# EAGLE design Backplane_Reference_R2_0 (EAGLE 6.6.0)
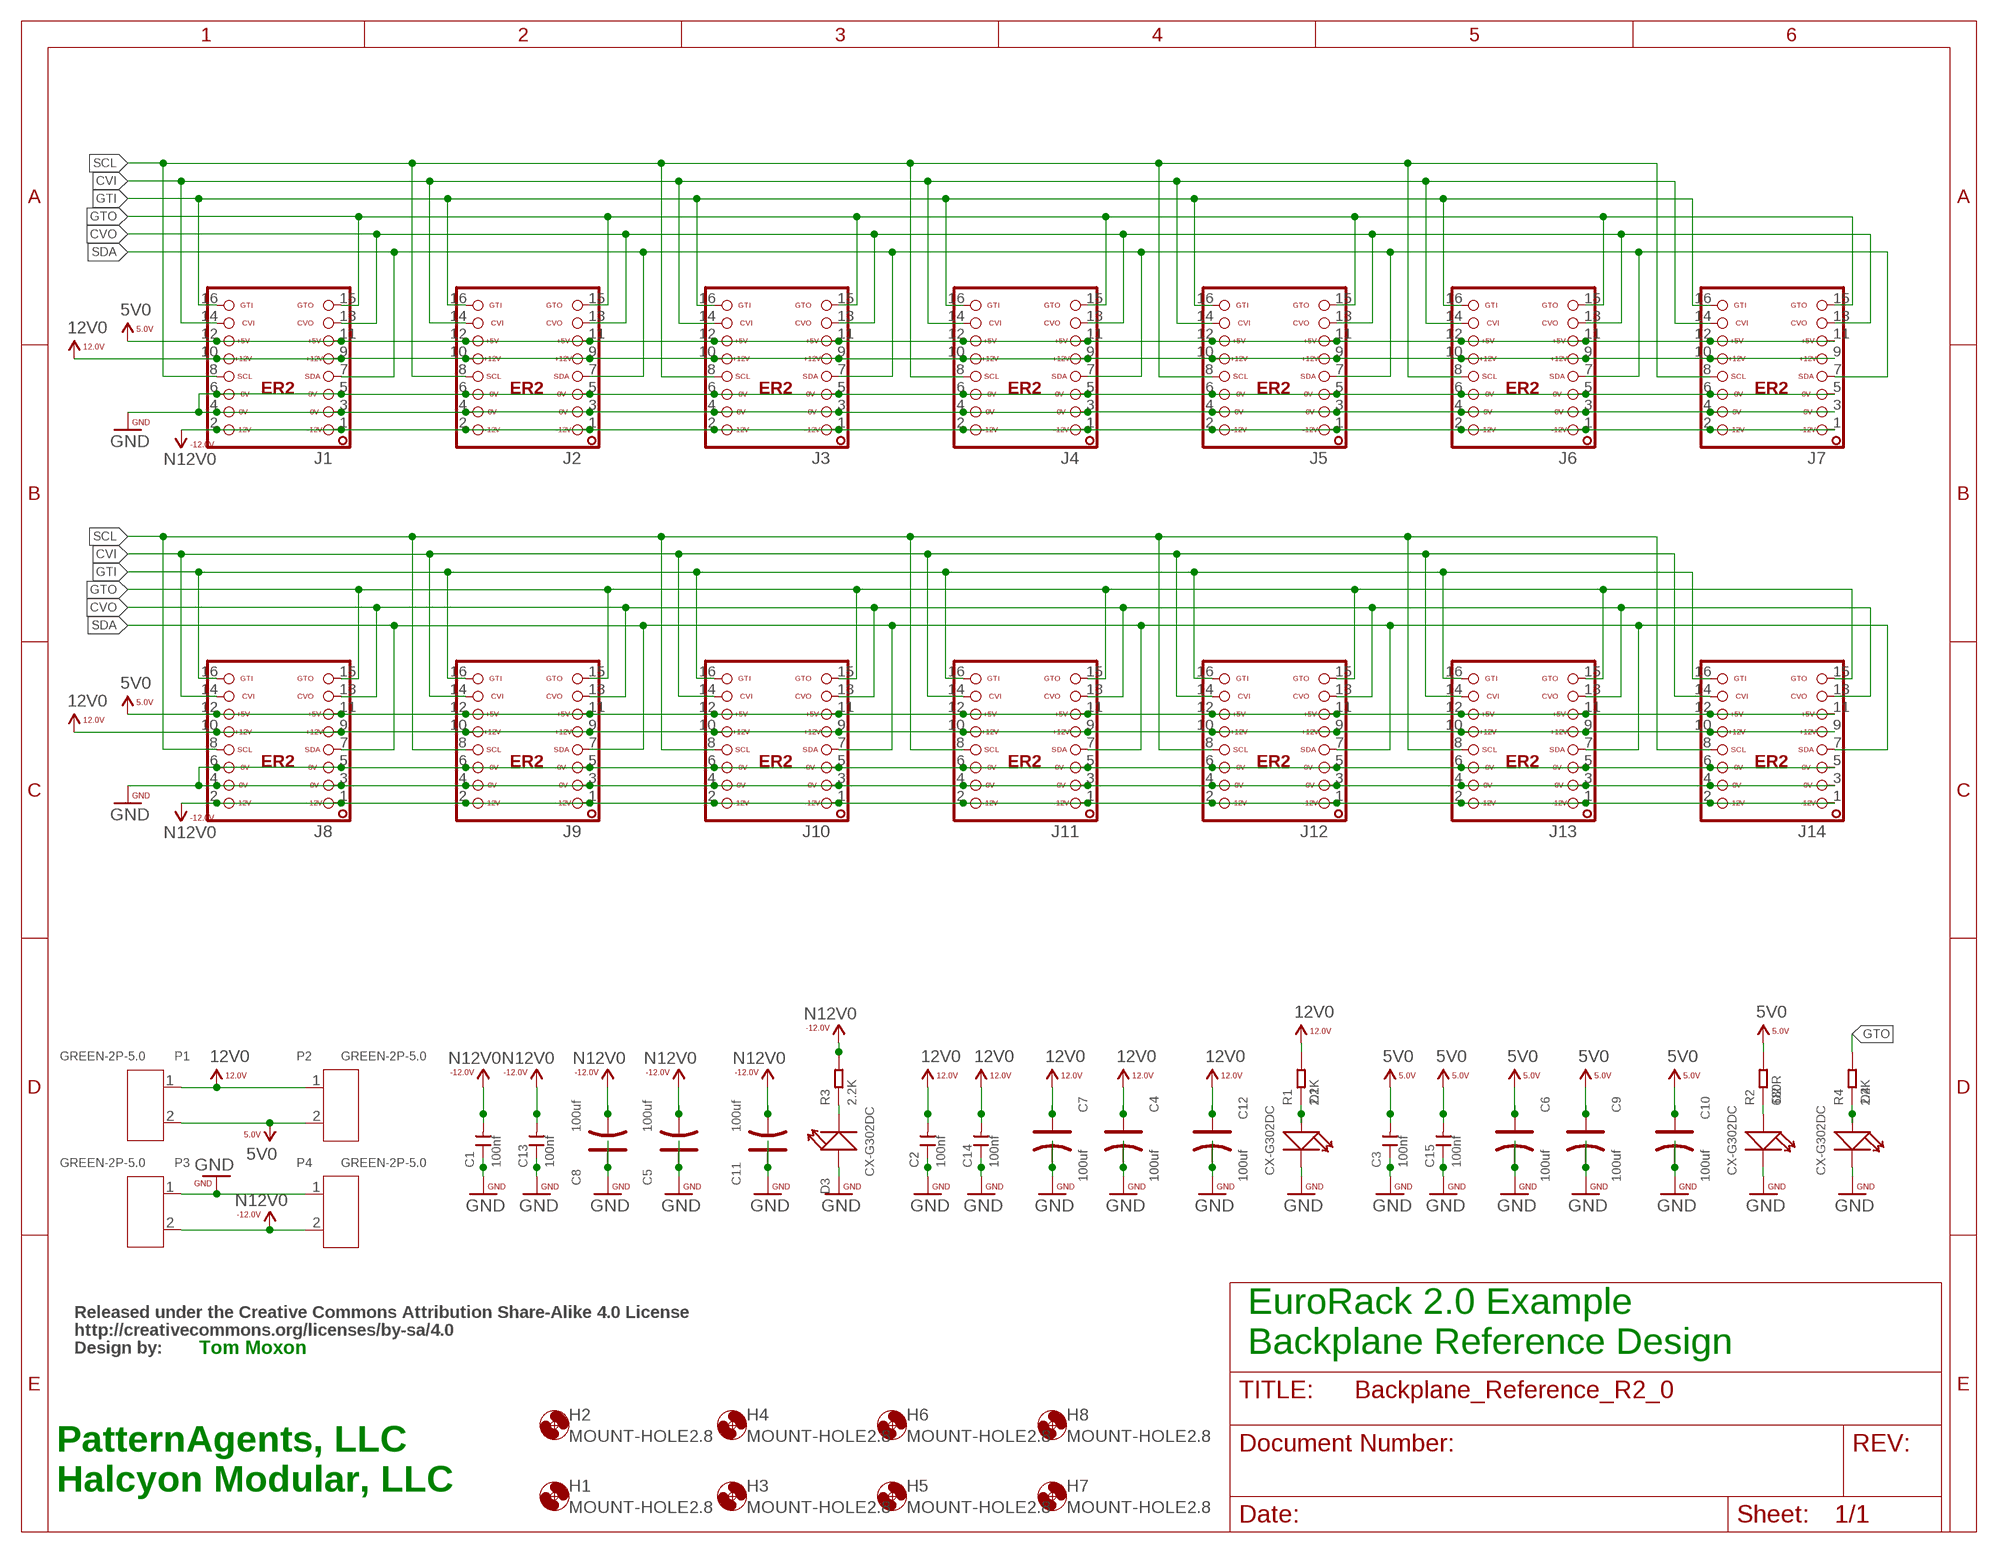
[diagram p0: schematic, sheet 1]

## Parts
C1  100nf  DIP-CERAMIC-DISC-100NF-50V-Y5V(D5.0MM)  [CERAMIC-2.54]
C2  100nf  DIP-CERAMIC-DISC-100NF-50V-Y5V(D5.0MM)  [CERAMIC-2.54]
C3  100nf  DIP-CERAMIC-DISC-100NF-50V-Y5V(D5.0MM)  [CERAMIC-2.54]
C4  100uf  DIP-ALUMINUM-100UF-16V(D5-H7MM)  [PC-D5.3MM]
C5  100uf  DIP-ALUMINUM-100UF-16V(D5-H7MM)  [PC-D5.3MM]
C6  100uf  DIP-ALUMINUM-100UF-16V(D5-H7MM)  [PC-D5.3MM]
C7  100uf  DIP-ALUMINUM-100UF-16V(D5-H7MM)  [PC-D5.3MM]
C8  100uf  DIP-ALUMINUM-100UF-16V(D5-H7MM)  [PC-D5.3MM]
C9  100uf  DIP-ALUMINUM-100UF-16V(D5-H7MM)  [PC-D5.3MM]
C10  100uf  DIP-ALUMINUM-100UF-16V(D5-H7MM)  [PC-D5.3MM]
C11  100uf  DIP-ALUMINUM-100UF-16V(D5-H7MM)  [PC-D5.3MM]
C12  100uf  DIP-ALUMINUM-100UF-16V(D5-H7MM)  [PC-D5.3MM]
C13  100nf  DIP-CERAMIC-DISC-100NF-50V-Y5V(D5.0MM)  [CERAMIC-2.54]
C14  100nf  DIP-CERAMIC-DISC-100NF-50V-Y5V(D5.0MM)  [CERAMIC-2.54]
C15  100nf  DIP-CERAMIC-DISC-100NF-50V-Y5V(D5.0MM)  [CERAMIC-2.54]
D1  CX-G302DC  DIP-LED-GREEN-GREEN(2P-D3MM)  [LED2-2.54-D3.0MM]
D2  CX-G302DC  DIP-LED-GREEN-GREEN(2P-D3MM)  [LED2-2.54-D3.0MM]
D3  CX-G302DC  DIP-LED-GREEN-GREEN(2P-D3MM)  [LED2-2.54-D3.0MM]
D4  CX-G302DC  DIP-LED-GREEN-GREEN(2P-D3MM)  [LED2-2.54-D3.0MM]
H1  MOUNT-HOLE2.8  [2,8]
H2  MOUNT-HOLE2.8  [2,8]
H3  MOUNT-HOLE2.8  [2,8]
H4  MOUNT-HOLE2.8  [2,8]
H5  MOUNT-HOLE2.8  [2,8]
H6  MOUNT-HOLE2.8  [2,8]
H7  MOUNT-HOLE2.8  [2,8]
H8  MOUNT-HOLE2.8  [2,8]
J1  ER2-SHROUD  [ER2]
J2  ER2-SHROUD  [ER2]
J3  ER2-SHROUD  [ER2]
J4  ER2-SHROUD  [ER2]
J5  ER2-SHROUD  [ER2]
J6  ER2-SHROUD  [ER2]
J7  ER2-SHROUD  [ER2]
J8  ER2-SHROUD  [ER2]
J9  ER2-SHROUD  [ER2]
J10  ER2-SHROUD  [ER2]
J11  ER2-SHROUD  [ER2]
J12  ER2-SHROUD  [ER2]
J13  ER2-SHROUD  [ER2]
J14  ER2-SHROUD  [ER2]
P1  GREEN-2P-5.0  SCREW-TERMINAL-GREEN(2P-5.0)  [H2-5.0-10.5X8.0MM]
P2  GREEN-2P-5.0  SCREW-TERMINAL-GREEN(2P-5.0)  [H2-5.0-10.5X8.0MM]
P3  GREEN-2P-5.0  SCREW-TERMINAL-GREEN(2P-5.0)  [H2-5.0-10.5X8.0MM]
P4  GREEN-2P-5.0  SCREW-TERMINAL-GREEN(2P-5.0)  [H2-5.0-10.5X8.0MM]
R1  2.2K  DIP-RES-2.2K-5%-1/4W(PR-D2.3XL6.5MM)  [PR-D2.3XL6.5MM]
R2  680R  DIP-RES-680R-5%-1/4W(PR-D2.3XL6.5MM)  [PR-D2.3XL6.5MM]
R3  2.2K  DIP-RES-2.2K-5%-1/4W(PR-D2.3XL6.5MM)  [PR-D2.3XL6.5MM]
R4  2.2K  DIP-RES-2.2K-5%-1/4W(PR-D2.3XL6.5MM)  [PR-D2.3XL6.5MM]
U$48  BY_CC_SA_TEXTTEXT  [BY_CC_SA_TEXT]

## Nets
5V0: C3.2 C6.+ C9.+ C10.+ C15.2 J1.11 J1.12 J2.11 J2.12 J3.11 J3.12 J4.11 J4.12 J5.11 J5.12 J6.11 J6.12 J7.11 J7.12 J8.11 J8.12 J9.11 J9.12 J10.11 J10.12 J11.11 J11.12 J12.11 J12.12 J13.11 J13.12 J14.11 J14.12 P1.2 P2.2 R2.2
12V0: C2.2 C4.+ C7.+ C12.+ C14.2 J1.9 J1.10 J2.9 J2.10 J3.9 J3.10 J4.9 J4.10 J5.9 J5.10 J6.9 J6.10 J7.9 J7.10 J8.9 J8.10 J9.9 J9.10 J10.9 J10.10 J11.9 J11.10 J12.9 J12.10 J13.9 J13.10 J14.9 J14.10 P1.1 P2.1 R1.2
CVI: J1.14 J2.14 J3.14 J4.14 J5.14 J6.14 J7.14 J8.14 J9.14 J10.14 J11.14 J12.14 J13.14 J14.14
CVO: J1.13 J2.13 J3.13 J4.13 J5.13 J6.13 J7.13 J8.13 J9.13 J10.13 J11.13 J12.13 J13.13 J14.13
GND: C1.1 C2.1 C3.1 C4.- C5.+ C6.- C7.- C8.+ C9.- C10.- C11.+ C12.- C13.1 C14.1 C15.1 D1.K(-) D2.K(-) D3.A(+) D4.K(-) J1.3 J1.4 J1.5 J1.6 J2.3 J2.4 J2.5 J2.6 J3.3 J3.4 J3.5 J3.6 J4.3 J4.4 J4.5 J4.6 J5.3 J5.4 J5.5 J5.6 J6.3 J6.4 J6.5 J6.6 J7.3 J7.4 J7.5 J7.6 J8.3 J8.4 J8.5 J8.6 J9.3 J9.4 J9.5 J9.6 J10.3 J10.4 J10.5 J10.6 J11.3 J11.4 J11.5 J11.6 J12.3 J12.4 J12.5 J12.6 J13.3 J13.4 J13.5 J13.6 J14.3 J14.4 J14.5 J14.6 P3.1 P4.1
GTI: J1.16 J2.16 J3.16 J4.16 J5.16 J6.16 J7.16 J8.16 J9.16 J10.16 J11.16 J12.16 J13.16 J14.16
GTO: J1.15 J2.15 J3.15 J4.15 J5.15 J6.15 J7.15 J8.15 J9.15 J10.15 J11.15 J12.15 J13.15 J14.15 R4.2
N12V0: C1.2 C5.- C8.- C11.- C13.2 J1.1 J1.2 J2.1 J2.2 J3.1 J3.2 J4.1 J4.2 J5.1 J5.2 J6.1 J6.2 J7.1 J7.2 J8.1 J8.2 J9.1 J9.2 J10.1 J10.2 J11.1 J11.2 J12.1 J12.2 J13.1 J13.2 J14.1 J14.2 P3.2 P4.2 R3.2
N$1: D3.K(-) R3.1
N$2: D1.A(+) R1.1
N$3: D2.A(+) R2.1
N$4: D4.A(+) R4.1
SCL: J1.8 J2.8 J3.8 J4.8 J5.8 J6.8 J7.8 J8.8 J9.8 J10.8 J11.8 J12.8 J13.8 J14.8
SDA: J1.7 J2.7 J3.7 J4.7 J5.7 J6.7 J7.7 J8.7 J9.7 J10.7 J11.7 J12.7 J13.7 J14.7

## Notes on the sheet
- Tom Moxon
- EuroRack 2.0 Example
  Backplane Reference Design
- PatternAgents, LLC
  Halcyon Modular, LLC

## Library data of the parts
C1-C3 C13-C15 = Seeed-Capacitor-2016:DIP-CERAMIC-DISC-100NF-50V-Y5V(D5.0MM): 302010208; MPN: CC1-F5SL2A101KSPW
C4-C12 = Seeed-Capacitor-2016:DIP-ALUMINUM-100UF-16V(D5-H7MM): 302030031; MPN: KS 100uF/16V
D1-D4 = Seeed-LED-2016:DIP-LED-GREEN-GREEN(2P-D3MM): 304090040; MPN: CX-G302DC
H1-H8 = euro_rack:MOUNT-HOLE: MOUNTING HOLE with drill center marker
J1-J14 = ER2:ER2: EuroRack2 - Backplane Connector
P1-P4 = Seeed-Connector -2016:SCREW-TERMINAL-GREEN(2P-5.0): 320110031
R1 R3 R4 = Seeed-Resistor-2016:DIP-RES-2.2K-5%-1/4W(PR-D2.3XL6.5MM): 301020010; MPN: FHCFR-1/4W-222J
R2 = Seeed-Resistor-2016:DIP-RES-680R-5%-1/4W(PR-D2.3XL6.5MM): 301020007; MPN: FHCFR-1/4W-681J
U$48 = PatternAgents-Logos:BY_CC_SA_TEXT: BY_CC_SA_TEXT Source : http://wiki.creativecommons.org/CC_markers Github : https://github.com/PatternAgents/PCB_Libraries License : http://creativecommons.org/licenses/by-sa/4.0/ (Creative Commons 4.0) THIS SOFTWARE IS PROVIDED BY THE CONTRIBUTORS "AS IS" AND WITHOUT ANY EXPRESS OR IMPLIED WARRANTIES, INCLUDING, BUT NOT LIMITED TO, THE IMPLIED WARRANTIES OF MERCHANTABILITY AND FITNESS FOR A PARTICULAR PURPOSE ARE DISCLAIMED. IN NO EVENT SHALL THE COPYRIGHT OWNER OR CONTRIBUTORS BE LIABLE FOR ANY DIRECT, INDIRECT, INCIDENTAL, SPECIAL, EXEMPLARY, OR CONSEQUENTIAL DAMAGES (INCLUDING, BUT NOT LIMITED TO, PROCUREMENT OF SUBSTITUTE GOODS OR SERVICES; LOSS OF USE, DATA, OR PROFITS; OR BUSINESS INTERRUPTION) HOWEVER CAUSED AND ON ANY THEORY OF LIABILITY, WHETHER IN CONTRACT, STRICT LIABILITY, OR TORT (INCLUDING NEGLIGENCE OR OTHERWISE) ARISING IN ANY WAY OUT OF THE USE OF THIS SOFTWARE, EVEN IF ADVISED OF THE POSSIBILITY OF SUCH DAMAGE.

## Board
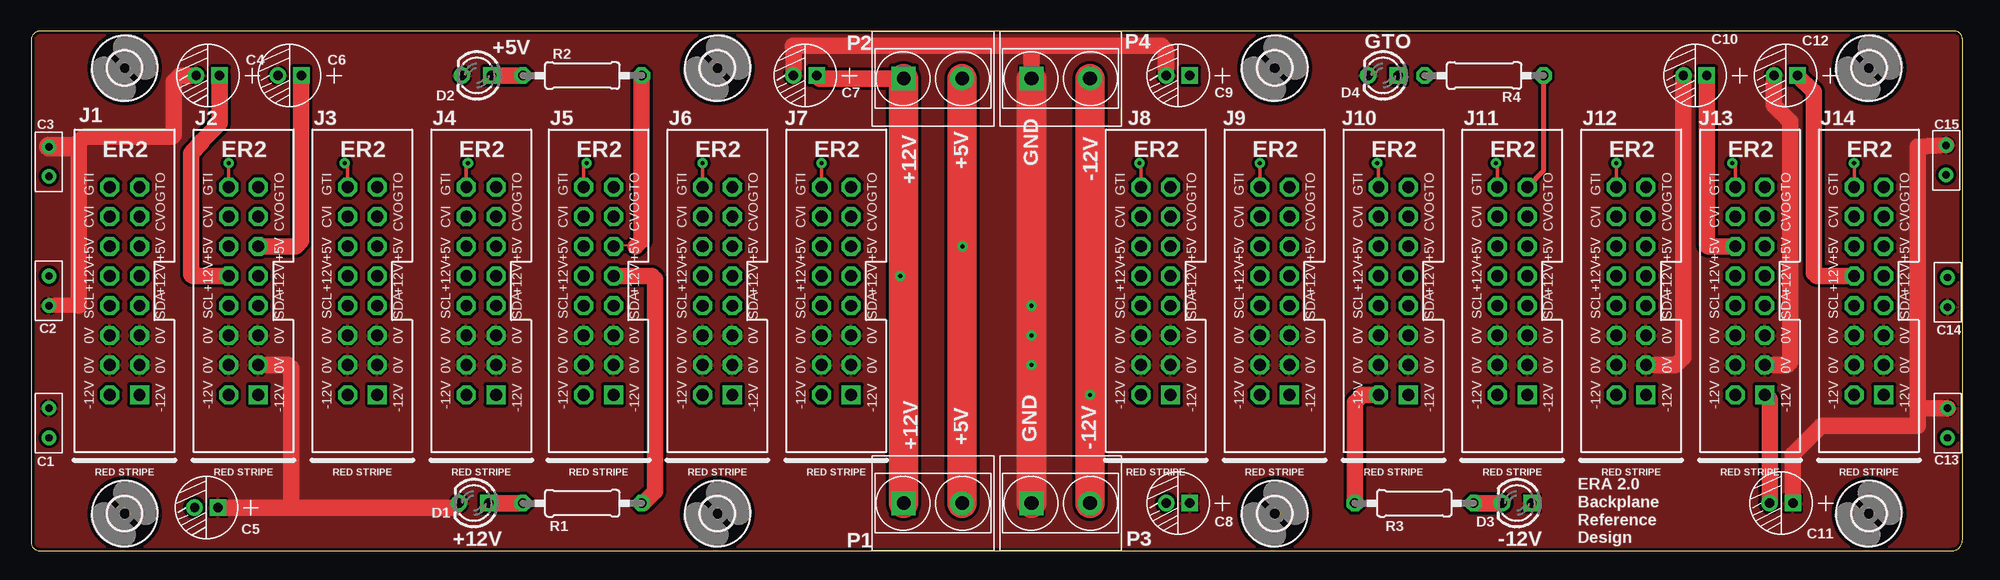
[diagram p1: board, top side]
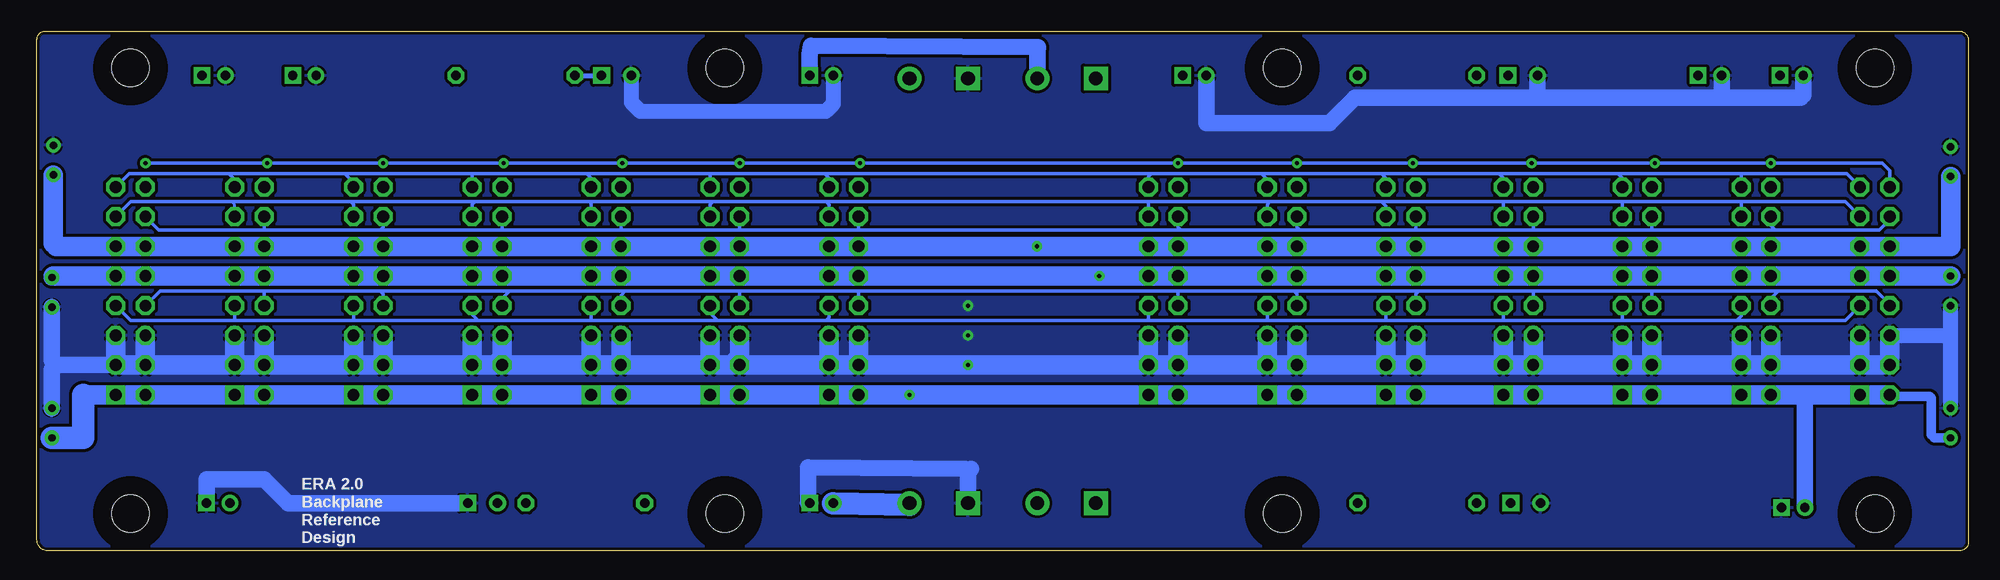
[diagram p2: board, bottom side, seen from below]

Size 165.1 x 44.45 mm. Coordinates in mm from the lower left corner, seen from the top.
Outline: 0,43.64 0,0.74 arc90 0.74,0 164.18,0 arc90 165.1,0.92 165.1,43.73 arc90 164.38,44.45 0.81,44.45 arc90 0,43.64
Copper layers (1*16): Top 0.035mm / dielectric 1.5mm / Bottom 0.035mm
Design rules "PatternAgents_7mil": minimum track width 7mil, minimum drill 14mil, track to track 7mil, track to pad 7mil, pad to pad 7mil, via to via 7mil, smd to smd 7mil, copper to edge 7mil, drill to drill 7mil, minimum pad ring 12mil, minimum via ring 10mil, stop-mask expansion 4mil, vias tented up to drill 25mil, thermal gap 7mil

### Footprints (pad centres in the part's own frame; a part is rotated, then mirrored left to right if it is on the bottom)
CERAMIC-2.54 = drill 0.635 pad 1.143: 1 -1.27,0; 2 1.27,0
PC-D5.3MM = drill 0.8 pad 1.35 square: + -1,0 | drill 0.8 pad 1.35: - 1,0
LED2-2.54-D3.0MM = drill 0.813 square: A -1.27,0 | drill 0.813: K 1.27,0
2,8 = hole 3.2: 0,0
ER2 = drill 1.016 square: 1 -8.89,-1.27 | drill 1.016 octagon: 2 -8.89,1.27; 3 -6.35,-1.27; 4 -6.35,1.27; 5 -3.81,-1.27; 6 -3.81,1.27; 7 -1.27,-1.27; 8 -1.27,1.27; 9 1.27,-1.27; 10 1.27,1.27; 11 3.81,-1.27; 12 3.81,1.27; 13 6.35,-1.27; 14 6.35,1.27; 15 8.89,-1.27; 16 8.89,1.27
H2-5.0-10.5X8.0MM = drill 1.168 pad 2.032 square: 1 0,2.5 | drill 1.168 pad 2.032: 2 0,-2.5
PR-D2.3XL6.5MM = drill 0.813 octagon: 1 -4.953,0; 2 5.207,0

### Placement (x,y rotation side)
C1  1.52,10.92 270 top
C2  1.52,22.23 90 top
C3  1.52,33.27 270 top
C4  15.11,40.64 180 top
C5  14.99,3.68 180 top
C6  22.1,40.64 180 top
C7  66.17,40.64 180 top
C8  98.04,4.06 180 top
C9  98.04,40.64 180 top
C10  142.24,40.64 180 top
C11  149.61,4.06 180 top
C12  149.99,40.64 180 top
C13  163.83,10.92 270 top
C14  163.83,22.1 90 top
C15  163.7,33.4 270 top
D1  37.85,4.06 180 top
D2  38.1,40.64 180 top
D3  127,4.06 180 top
D4  115.57,40.64 180 top
H1  8,3.17 0 top
H2  8,41.27 0 top
H3  58.67,3.17 0 top
H4  58.67,41.27 0 top
H5  106.3,3.17 0 top
H6  106.3,41.27 0 top
H7  157.1,3.17 0 top
H8  157.1,41.27 0 top
J1  8,22.23 90 top
J2  18.16,22.23 90 top
J3  28.32,22.23 90 top
J4  38.48,22.23 90 top
J5  48.51,22.23 90 top
J6  58.67,22.23 90 top
J7  68.83,22.23 90 top
J8  96.14,22.23 90 top
J9  106.3,22.23 90 top
J10  116.46,22.23 90 top
J11  126.62,22.23 90 top
J12  136.78,22.23 90 top
J13  146.94,22.23 90 top
J14  157.1,22.23 90 top
P1  77.09,4.06 90 top
P2  77.09,40.39 90 top
P3  88.01,4.06 90 top
P4  88.01,40.39 90 top
R1  46.99,4.06 0 top
R2  46.99,40.64 0 top
R3  118.36,4.06 180 top
R4  124.08,40.64 0 top
U$48  20.83,-7.87 0 top  (outside the outline)

### Tracks (layer width: path | path; a pad name or v marks a point on that pad's centre or on a via)
5V0  (via drill 0.36)
  Top 0.178: 51.69,26.04 51.05,26.16 49.78,26.16 J5.11
  Top 1.422: C10.+ 143.24,26.18 143.38,26.04 J13.12 | R2.2 52.2,26.54 51.69,26.04 | C6.+ 23.1,26.53 22.61,26.04 J2.11 | 79.59,26.16 79.59,25.44 79.63,25.4 v79.63,26.04
  Top 2.54: P1.2 79.59,26.16 P2.2
  Bottom 1.422: P2.2 79.59,42.71 | 79.59,42.71 79.63,43.05 | C9.+ 99.04,42.43 98.93,43.18 79.55,43.05 79.59,42.71
  Bottom 1.676: C3.2 1.52,26.04 J1.12 J1.11 J2.12 J2.11 J3.12 J3.11 J4.12 J4.11 J5.12 J5.11 J6.12 J6.11 J7.12 J7.11 v79.63,26.04 J8.12 J8.11 J9.12 J9.11 J10.12 J10.11 J11.12 J11.11 J12.12 J12.11 J13.12 J13.11 J14.12 J14.11 163.45,26.04 163.7,26.29 C15.2
12V0  (via drill 0.36)
  Top 1.422: R1.2 52.32,4.06 53.34,5.08 53.34,23.24 53.09,23.5 J5.9 | P2.1 67.42,40.39 C7.+ | J2.10 13.84,23.5 13.7,23.64 13.7,34.02 14.61,34.92 14.61,35.05 16.13,36.58 16.13,40.62 C4.+ | J14.10 152.65,23.5 152.38,23.77 152.38,39.24 C12.+
  Top 1.93: v74.3,23.5 74.59,23.5
  Top 2.54: P1.1 74.59,23.5 P2.1
  Bottom 1.422: 163.7,23.5 C14.2
  Bottom 1.676: 163.7,23.5 J14.9 J14.10 J13.9 J13.10 J12.9 J12.10 J11.9 J11.10 J10.9 J10.10 J9.9 J9.10 J8.9 J8.10 v74.3,23.5 J7.9 J7.10 J6.9 J6.10 J5.9 J5.10 J4.9 J4.10 J3.9 J3.10 J2.9 J2.10 J1.9 J1.10 C2.2
CVI
  Bottom 0.305: J1.14 6.73,28.32 7.62,27.43 16.51,27.43 | 16.51,27.43 27.18,27.43 | 27.18,27.43 37.21,27.43 | 37.21,27.43 47.12,27.43 | 47.12,27.43 57.15,27.43 | 57.15,27.43 67.31,27.43 | 67.31,27.43 95,27.43 | 95,27.43 104.9,27.43 | 104.9,27.43 115.06,27.43 | 115.06,27.43 125.22,27.43 | 125.22,27.43 135.76,27.43 | 135.76,27.43 145.8,27.43 | 145.8,27.43 154.69,27.43 J14.14 | J2.14 16.89,27.81 16.51,27.43 | J3.14 27.05,27.56 27.18,27.43 | J4.14 37.21,27.43 | J5.14 47.24,27.56 47.12,27.43 | J6.14 57.4,27.69 57.15,27.43 | J7.14 67.56,27.69 67.31,27.43 | J8.14 94.87,27.56 95,27.43 | J9.14 105.03,27.56 104.9,27.43 | J10.14 115.19,27.56 115.06,27.43 | J11.14 125.35,27.56 125.22,27.43 | J12.14 135.51,27.69 135.76,27.43 | J13.14 145.67,27.56 145.8,27.43
CVO
  Bottom 0.254: J13.13 148.21,29.59 148.46,29.84
  Bottom 0.305: J14.13 157.1,29.84 148.46,29.84 138.3,29.84 | 138.3,29.84 127.64,29.84 | 127.64,29.84 117.73,29.84 | 117.73,29.84 107.31,29.84 | 107.31,29.84 97.66,29.84 | 97.66,29.84 69.98,29.84 | 69.98,29.84 59.69,29.84 | 59.69,29.84 50.16,29.84 | 50.16,29.84 39.75,29.84 | 39.75,29.84 29.59,29.84 | 29.59,29.84 19.3,29.84 | 19.3,29.84 10.54,29.84 J1.13 | J2.13 19.43,29.72 19.3,29.84 | J3.13 29.59,29.84 | J4.13 39.75,29.84 | J5.13 49.78,29.46 50.16,29.84 | J6.13 59.94,29.59 59.69,29.84 | J7.13 70.1,29.72 69.98,29.84 | J8.13 97.41,29.59 97.66,29.84 | J9.13 107.57,29.59 107.31,29.84 | J10.13 117.73,29.84 | J11.13 127.89,29.59 127.64,29.84 | J12.13 138.05,29.59 138.3,29.84
GND  (via drill 0.36)
  Top 0.813: 3.94,34.54 4.06,34.42
  Top 1.27: 4.06,20.95 C2.1
  Top 1.422: C15.1 161.29,34.54 161.29,12.19 | 161.29,12.19 C13.1 | 4.06,20.95 4.06,34.42 4.06,34.92 4.57,35.43 12.06,35.43 12.19,35.56 12.19,40.13 12.7,40.64 C4.- | C5.+ 22.23,3.68 | 22.23,3.68 22.23,15.62 21.97,15.88 J2.3 | P4.1 85.51,42.71 | 85.51,42.71 85.6,43.18 96.65,43.18 97.03,42.8 97.03,40.66 C9.- | C7.- 65.17,42.69 65.15,43.18 85.51,43.18 85.51,42.71 | 161.29,12.19 161.29,10.67 153.03,10.67 150.61,8.24 C11.+ | C10.- 141.24,16.53 140.59,15.88 J12.3 | J13.3 150.11,15.88 150.37,16.13 150.37,20.95 150.38,20.97 150.38,36.69 148.97,38.1 148.97,40.62 C12.- | 22.23,3.68 36.2,3.68 D1.K
  Top 1.676: C3.1 3.94,34.54
  Top 2.54: P3.1 v85.51,15.88 v85.51,18.41 v85.51,20.95 P4.1
  Bottom 1.27: D4.K 114.3,38.35 113.54,37.59 97.66,37.59 97.04,38.21 C9.- | C1.1 1.52,18.41 | 1.52,18.41 C2.1 | J1.6 1.52,18.41
  Bottom 1.422: C8.+ 99.19,4.08 99.19,7.11 85.77,6.99 85.51,6.73 | 85.26,6.99 85.51,6.73 | 85.51,6.73 P3.1 | C4.- 14.11,38.97 14.35,38.73 20.95,38.73 | 20.95,38.73 36.7,38.73 | 36.7,38.73 52.45,38.73 54.61,36.58 65.15,36.58 65.15,40.64 | D2.K 36.83,38.86 36.7,38.73 | C6.- 21.1,38.88 20.95,38.73 | D3.A 143.64,4.06 145.67,6.1 150.61,6.1 C11.+ | C14.1 163.83,16.26 163.45,15.88 | 163.45,15.88 J14.3 | C13.1 163.83,15.49 163.45,15.88
  Bottom 1.676: J1.3 J1.4 J1.6 | J2.4 J1.3 | J2.3 J2.4 | J2.6 J2.4 | J2.5 J2.3 | J1.5 J1.3 | J2.3 J3.4 | J3.4 J3.3 | J4.4 J3.3 | J4.3 J4.4 | J5.4 J4.3 | J3.6 J3.4 | J3.5 J3.3 | J4.6 J4.4 | J4.5 J4.3 | J5.4 J5.3 | J6.4 J5.3 | J6.3 J6.4 | J7.4 J6.3 | J7.3 J7.4 | J8.4 J7.3 | J8.3 J8.4 | J5.6 J5.4 | J5.5 J5.3 | J6.6 J6.4 | J6.5 J6.3 | J7.6 J7.4 | J7.5 J7.3 | J8.6 J8.4 | J8.5 J8.3 | J8.3 J9.4 105.79,15.88 | 105.79,15.88 J9.3 108.08,15.88 | 108.08,15.88 J10.4 115.7,15.88 | J10.3 115.7,15.88 | J10.3 J11.4 125.98,15.88 | J11.3 125.98,15.88 | J12.4 J11.3 | J12.4 J12.3 138.56,15.88 | J13.4 138.56,15.88 | J13.3 J13.4 | J14.4 J13.3 | J14.4 J14.3 J14.5 | J14.6 J14.4 | J13.5 J13.3 | J13.6 J13.4 | J12.5 138.05,16.38 138.56,15.88 | J12.6 J12.4 | J11.5 J11.3 | J11.6 125.35,16.51 125.98,15.88 | J10.5 J10.3 | J10.6 115.19,16.38 115.7,15.88 | J9.5 107.57,16.38 108.08,15.88 | J9.6 105.03,16.64 105.79,15.88
  pour Top (isolate 0.254, hatched): 0,0 0,44.45 165.1,44.45 165.1,0
  pour Bottom (isolate 0.254, hatched): 0,0 0,44.45 165.1,44.45 165.1,0
GTI  (via drill 0.36)
  Top 0.305: v16.89,33.15 J2.16 | v155.83,33.15 J14.16 | J3.16 27.05,32.89 v26.8,33.15 | J4.16 37.21,33.02 v37.34,33.15 | J5.16 47.24,32.89 v47.5,33.15 | J6.16 v57.4,33.15 | J7.16 v67.56,33.15 | J8.16 94.87,33.02 v94.74,33.15 | J9.16 v105.03,33.15 | J10.16 115.19,33.02 v115.06,33.15 | J11.16 125.35,33.02 v125.22,33.15 | J12.16 v135.51,33.15 | J13.16 145.67,32.89 v145.41,33.15
  Bottom 0.178: v16.89,33.15 17.02,33.27 17.02,33.15
  Bottom 0.305: J1.16 6.73,32.51 7.37,33.15 v16.89,33.15 17.02,33.15 v26.8,33.15 v37.34,33.15 v47.5,33.15 v57.4,33.15 v67.56,33.15 v94.74,33.15 v105.03,33.15 v115.06,33.15 v125.22,33.15 v135.51,33.15 v145.41,33.15 v155.83,33.15
GTO
  Top 0.406: R4.2 129.29,32.51 J11.15
  Bottom 0.305: J1.15 10.41,32.26 19.56,32.26 | 19.56,32.26 29.97,32.26 | 29.97,32.26 40.13,32.26 | 40.13,32.26 50.16,32.26 | 50.16,32.26 60.45,32.26 | 60.45,32.26 69.85,32.26 | 69.85,32.26 97.79,32.26 | 97.79,32.26 107.7,32.26 | 107.7,32.26 118.11,32.26 | 118.11,32.26 128.02,32.26 | 128.02,32.26 138.81,32.26 | 138.81,32.26 148.72,32.26 | 148.72,32.26 157.23,32.26 J14.15 | J13.15 148.21,31.75 148.72,32.26 | J12.15 138.05,31.5 138.81,32.26 | J11.15 127.89,32.13 128.02,32.26 | J10.15 117.73,31.88 118.11,32.26 | J9.15 107.57,32.13 107.7,32.26 | J8.15 97.41,31.88 97.79,32.26 | J6.15 59.94,31.75 60.45,32.26 | J7.15 70.1,32 69.85,32.26 | J5.15 49.78,31.88 50.16,32.26 | J4.15 39.75,31.88 40.13,32.26 | J3.15 29.59,31.88 29.97,32.26 | J2.15 19.43,32.13 19.56,32.26
N12V0  (via drill 0.36)
  Top 1.422: R3.2 113.16,12.7 113.79,13.34 J10.2 | C11.- 148.61,12.94 J13.1
  Top 2.54: P3.2 v90.51,13.34 P4.2
  Bottom 0.178: 6.1,13.21 J1.2
  Bottom 0.813: C1.2 2.92,9.65 3.17,9.91 3.17,13.08 3.3,13.21 6.1,13.21 6.6,13.21
  Bottom 1.422: C5.- 13.99,13.1 14.22,13.34
  Bottom 1.676: J1.2 J1.1 14.22,13.34 J2.2 J2.1 J3.2 J3.1 J4.2 J4.1 J5.2 J5.1 J6.2 J6.1 J7.2 J7.1 v90.51,13.34 J8.2 J8.1 J9.2 J9.1 J10.2 J10.1 J11.2 J11.1 J12.2 J12.1 J13.2 J13.1 J14.2 J14.1 161.16,13.34
  Bottom 1.93: C8.- 90.51,3.94 P3.2 | 161.16,13.34 161.16,9.65 C13.2
N$1
  Top 1.422: R3.1 D3.K
N$2
  Top 1.422: D1.A R1.1
N$3
  Top 1.422: R2.1 D2.A
N$4
  Bottom 0.406: R4.1 D4.A
SCL
  Bottom 0.305: J1.8 6.73,21.08 7.87,22.23 16.26,22.23 | 16.26,22.23 26.92,22.23 | 26.92,22.23 37.08,22.23 | 37.08,22.23 46.99,22.23 | 46.99,22.23 57.66,22.23 | 57.66,22.23 67.56,22.23 | 67.56,22.23 95,22.23 | 95,22.23 104.9,22.23 | 104.9,22.23 114.81,22.23 | 114.81,22.23 124.71,22.23 | 124.71,22.23 135.76,22.23 | 135.76,22.23 145.54,22.23 | 145.54,22.23 154.56,22.23 J14.8 | J2.8 16.89,21.59 16.26,22.23 | J3.8 27.05,22.1 26.92,22.23 | J4.8 37.21,22.1 37.08,22.23 | J5.8 47.24,21.97 46.99,22.23 | J6.8 57.4,21.97 57.66,22.23 | J7.8 67.56,22.23 | J8.8 94.87,22.1 95,22.23 | J9.8 105.03,22.1 104.9,22.23 | J10.8 115.19,21.84 114.81,22.23 | J11.8 125.35,21.59 124.71,22.23 | J12.8 135.51,21.97 135.76,22.23 | J13.8 145.67,22.1 145.54,22.23
SDA
  Bottom 0.305: 19.81,19.68 10.54,19.68 J1.7 | J2.7 19.43,20.07 19.81,19.68 | 19.81,19.68 29.72,19.68 | 29.72,19.68 39.75,19.68 | 39.75,19.68 49.78,19.68 | 49.78,19.68 60.07,19.68 | 60.07,19.68 70.23,19.68 | 70.23,19.68 97.66,19.68 | 97.66,19.68 106.93,19.68 | 106.93,19.68 117.73,19.68 | 117.73,19.68 127.38,19.68 | 127.38,19.68 138.18,19.68 | 138.18,19.68 148.34,19.68 | 148.34,19.68 157.1,19.68 J14.7 | J3.7 29.59,19.81 29.72,19.68 | J4.7 39.75,19.68 | J5.7 49.78,19.68 | J6.7 59.94,19.81 60.07,19.68 | J7.7 70.1,19.81 70.23,19.68 | J8.7 97.41,19.94 97.66,19.68 | J9.7 107.57,20.32 106.93,19.68 | J10.7 117.73,19.68 | J11.7 127.89,20.19 127.38,19.68 | J12.7 138.05,19.81 138.18,19.68 | J13.7 148.21,19.81 148.34,19.68

### Text on the board
tPlace: +5V | GTO | +5V | GND | -12V | +12V | +12V | +5V | GND | -12V | +12V | -12V | ERA 2.0 / Backplane / Reference / Design
bPlace: ERA 2.0 / Backplane / Reference / Design
tDocu: Tom Moxon